# Altium project TAUV-Killswitch (DESKTOP-2772EO1's conflicted copy 2019-08-13).PrjPCB
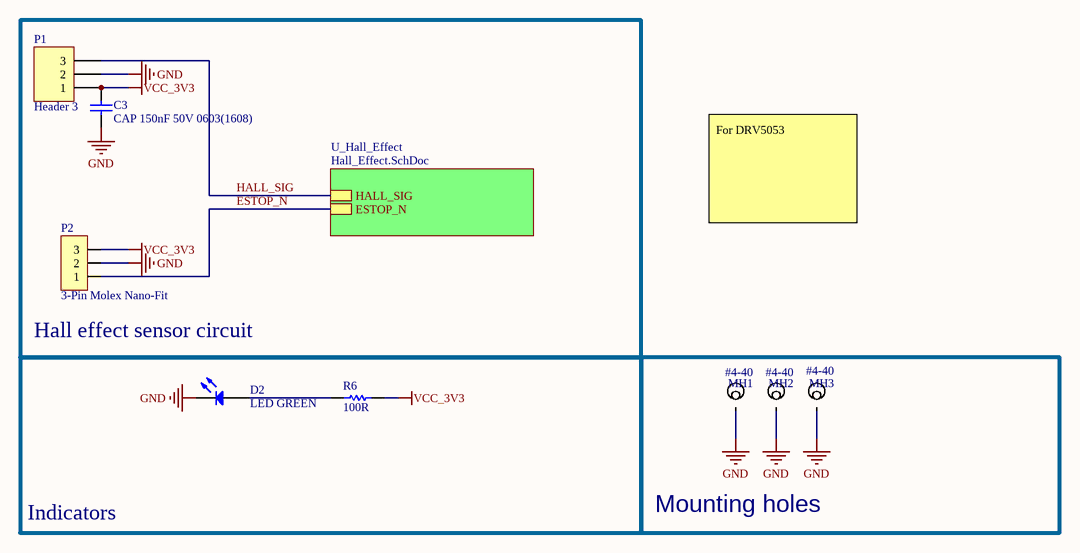
[diagram p0: Main.SchDoc]
2 sheets, 18 parts. Net scope: hierarchical (ports join the sheet entries above them; power ports are global).
Board file: TAUV-Killswitch.PcbDoc
Sheets:
  Main.SchDoc
    U_Hall_Effect = Hall_Effect.SchDoc

## Sheet Main.SchDoc
size A

### Parts
C3  CAP 150nF 50V 0603(1608)  [CAPC0603(1608)100_M]
D2  LED GREEN  [LED_0805]
MH1  #4-40  [Mounting Hole #4-40]
MH2  #4-40  [Mounting Hole #4-40]
MH3  #4-40  [Mounting Hole #4-40]
P1  Header 3  [HDR1X3]
P2  3-Pin Molex Nano-Fit  [MOLEX NANO-FIT 1X3]
R6  100R  [RESC0603(1608)_N]

### Blocks framed on the sheet
Hall effect sensor circuit: C3 P1 P2
Mounting holes: MH1-MH3

### Sub-sheets
U_Hall_Effect = Hall_Effect.SchDoc: ESTOP_N, HALL_SIG

### Nets
GND: C3.2 D2.1(K) MH1.0 MH2.0 MH3.0 P1.2 P2.2
VCC_3V3: C3.1 P1.1 P2.3 R6.2
ESTOP_N: P2.1 ; sheet U_Hall_Effect/ESTOP_N
HALL_SIG: P1.3 ; sheet U_Hall_Effect/HALL_SIG
NetD2_2: D2.2(A) R6.1

### Notes on the sheet
- For DRV5053
- Indicators

### Library data of the parts
C3 = CMP-1035-02624-1: CAP 150nF 50V -20% to +80% 0603 (1608 Metric) Thickness 1mm SMD; Case-Metric: 1608; Case-EIA: 0603; Max Thickness: 1 mm; Value: 150nF; Tolerance: -20% to +80%; Technology: SMT; Rated Voltage: 50 V
D2 = LED0: led; Manufacturer: Lite-On Inc.; Manufacturer Part Number: LTST-C171KGKT; Lens Color: Colorless; Lens Transparency: Clear; Millicandela Rating: 35mcd; Lens Style/Size: Rectangle with Flat Top, 1.40mm x 1.25mm; Voltage - Forward (Vf) (Typ): 2V; Current - Test: 20mA; Viewing Angle: 130°; Wavelength - Dominant: 571nm; Wavelength - Peak: 574nm; Supplier 1: Digi-Key; Supplier Part Number 1: 160-1426-1-ND; RoHS: RoHS Compliant; Category: Optoelectronics; Stock 1: 350441; Pricing 1: 1=0.31, 10=0.225, 25=0.1656, 100=0.1183, 250=0.0804, 500=0.07096, 1000=0.05558 (USD); Packaging: Cut Tape (CT); Part Status: Active; Color: Green; Mounting Type: Surface Mount; Features: -; Package / Case: 0805 (2012 Metric); Size / Dimension: 2.00mm L x 1.25mm W; Height (Max): 0.90mm; ComponentLink1URL: http://optoelectronics.liteon.com/upload/download/DS22-2000-118/LTST-C171KGKT.pdf; ComponentLink1Description: http://optoelectronics.liteon.com/upload/download/DS22-2000-118/LTST-C171KGKT.pdf
MH1-MH3 = Mounting Hole #4-40, Loose Fit: Mounting Hole for ANSI #4-40 w/ Flat Washer, Loose Fit; Datasheet: http://blogs.mentor.com/tom-hausherr/blog/tag/pcb-mounting-holes/
P1 = Header 3: Header, 3-Pin; LatestRevisionDate: 17-Jul-2002; LatestRevisionNote: Re-released for DXP Platform.; Publisher: Altium Limited
P2 = 3-Pin Nano-Fit: NanoFit RA Hdr TH SR 3Ckt; Part Number: 105313-1204; Supplier: Mouser; Manufacturer: Molex; Supplier Part Number: 538-105313-1204
R6 = CMP-1012-00050-1: 100R 0.1W 5% 0603 (1608 Metric)  SMD; Case-EIA: 0603; Value: 100.00 Ohm; Case-Metric: 1608; Tolerance: 5 %; Technology: SMT; Power: 0.1 W

## Sheet Hall_Effect.SchDoc
size A; SheetNumber: 9
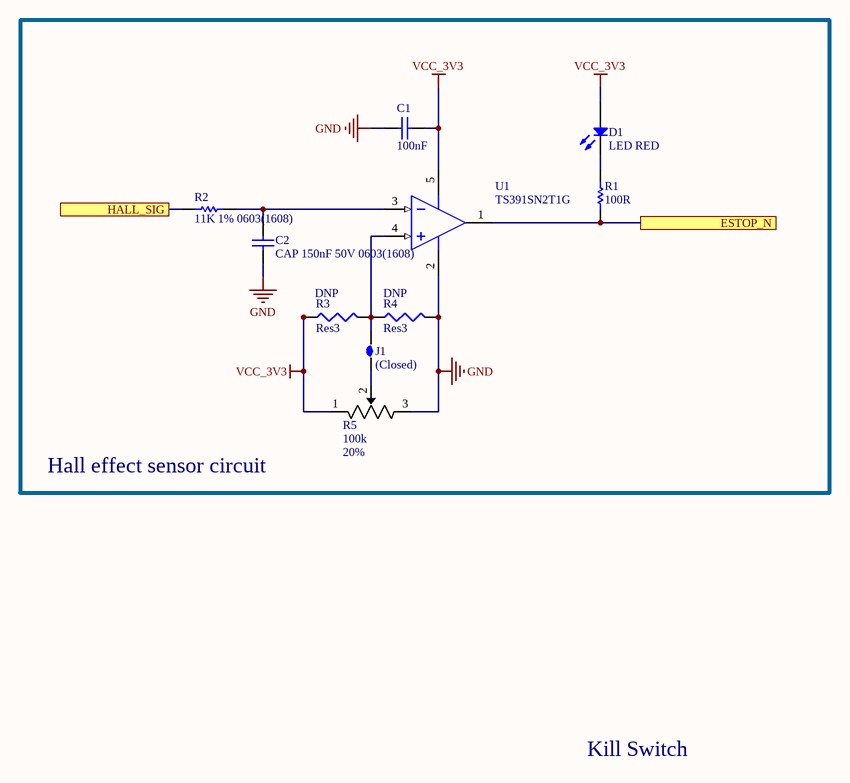
[diagram p1: Hall_Effect.SchDoc]

### Parts
C1  100nF  [CAPC0603(1608)100_N]
C2  CAP 150nF 50V 0603(1608)  [CAPC0603(1608)100_M]
D1  LED RED  [LED_0805]
J1  (Closed)  [Solder Jumper - Closed]
R1  100R  [RESC0603(1608)_N]
R2  11K 1% 0603(1608)  [RESC0603(1608)_M]
R3  Res3  value DNP  [J1-0603]
R4  Res3  value DNP  [J1-0603]
R5  value 100k  Tolerance: 20%  [TT BI 22A TRIM POT]  (hidden comment: 22AR100KLFTR)
U1  TS391SN2T1G  [ONSC-TSOP-5-483-02_V]

### Blocks framed on the sheet
Hall effect sensor circuit: C1 C2 D1 J1 R1-R5 U1

### Ports
ESTOP_N, HALL_SIG

### Nets
GND: C1.2 C2.1 R4.2 R5.3 U1.2(VEE)
VCC_3V3: C1.1 D1.2(A) R3.1 R5.1 U1.5(VCC)
ESTOP_N: R1.2 U1.1(OUT) ; port ESTOP_N
HALL_SIG: R2.1 ; port HALL_SIG
NetC2_2: C2.2 R2.2 U1.3(IN-)
NetD1_1: D1.1(K) R1.1
NetJ1_1: J1.1 R5.2
NetJ1_2: J1.2 R3.2 R4.1 U1.4(IN+)

### Notes on the sheet
- Kill Switch

### Library data of the parts
C1 = CMP-1035-02580-1: CAP 100nF 10V ±10% 0603 (1608 Metric) Thickness 1mm SMD; Tolerance: Â±10%; Case-EIA: 0603; Case-Metric: 1608; Max Thickness: 1 mm; Value: 100nF; Rated Voltage: 10 V; Technology: SMT
C2 = CMP-1035-02624-1: as C3 on sheet Main; Max Thickness: 1 mm; Value: 150nF; Tolerance: -20% to +80%; Technology: SMT; Rated Voltage: 50 V
D1 = LED0: led; Manufacturer: Lite-On Inc.; Manufacturer Part Number: LTST-C171KRKT; Lens Color: Colorless; Lens Transparency: Clear; Millicandela Rating: 54mcd; Lens Style/Size: Rectangle with Flat Top, 1.40mm x 1.25mm; Voltage - Forward (Vf) (Typ): 2V; Current - Test: 20mA; Viewing Angle: 130°; Wavelength - Dominant: 631nm; Wavelength - Peak: 639nm; Supplier 1: Digi-Key; Supplier Part Number 1: 160-1427-1-ND; RoHS: RoHS Compliant; Category: Optoelectronics; Stock 1: 260544; Pricing 1: 1=0.31, 10=0.225, 25=0.1656, 100=0.1183, 250=0.0804, 500=0.07096, 1000=0.05558 (USD); Packaging: Cut Tape (CT); Part Status: Active; Color: Red; Mounting Type: Surface Mount; Features: -; Package / Case: 0805 (2012 Metric); Size / Dimension: 2.00mm L x 1.25mm W; Height (Max): 0.80mm; ComponentLink1URL: http://optoelectronics.liteon.com/upload/download/DS22-2000-109/LTST-C171KRKT.pdf; ComponentLink1Description: http://optoelectronics.liteon.com/upload/download/DS22-2000-109/LTST-C171KRKT.pdf
J1 = Jumper Closed: Jumper
R1 = CMP-1012-00050-1: as R6 on sheet Main; Tolerance: 5 %; Technology: SMT; Power: 0.1 W
R2 = CMP-1012-00627-1: 11K 0.1W 1% 0603 (1608 Metric)  SMD; Value: 11000.00 Ohm; Case-Metric: 1608; Case-EIA: 0603; Technology: SMT; Power: 0.1 W; Tolerance: 1 %
R3 R4 = Res3: Resistor; Published: 8-Jun-2000; LatestRevisionDate: 29-May-2009; LatestRevisionNote: IPC-7351 Footprint Added.; PackageReference: J1-0603; Publisher: Altium Limited; PackageDescription: Chip Resistor
R5 = TT 22AR Trim Pot: TT Electronics BI 22AR100KLFTR SMT trim pot, 100k 20%; Supplier 1: Digi-Key; Supplier Part Number 1: 987-1003-1-ND; Datasheet: http://www.bitechnologies.com/pdfs/22.pdf
U1 = CMP-1305-00060-1: Low Power Single Voltage Comparator, 2 to 36 V, -40 to 125 degC, 5-Pin TSOP, Pb-Free, Tape and Reel; Manufacturer: On Semiconductor; VCC Min (V): 2; VCC Max (V): 36; ICC Typ (mA): 0.5; IO Typ (mA): 16; DatasheetVersion: Rev. 3; Mounting Technology: Surface Mount; PackageVersion: Rev. K, 04/2013; ComponentLink2Description: Datasheet; ComponentLink3Description: Package Specification; ComponentLink3URL: http://www.onsemi.com/pub_link/Collateral/483.PDF; ComponentLink2URL: http://www.onsemi.com/pub_link/Collateral/TS391-D.PDF; Packing: Tape and Reel; ComponentLink1Description: Manufacturer URL; ComponentLink1URL: http://www.onsemi.com/; PackageReference: TSOP-5-483-02; PackageDescription: 5-Pin Small Outline Package, Body 3 x 1.5 mm, Pitch 0.95 mm; PartNumber: TS391SN2T1G; RoHS: TRUE

## Nets that join several sheets
GND: Main (7 pins), Hall_Effect (5 pins)
VCC_3V3: Main (C3.1 P1.1 P2.3 R6.2), Hall_Effect (5 pins)
ESTOP_N: Main (P2.1), Hall_Effect (R1.2 U1.1)
HALL_SIG: Main (P1.3), Hall_Effect (R2.1)